# EAGLE design clock-digits (EAGLE 7.5.0)
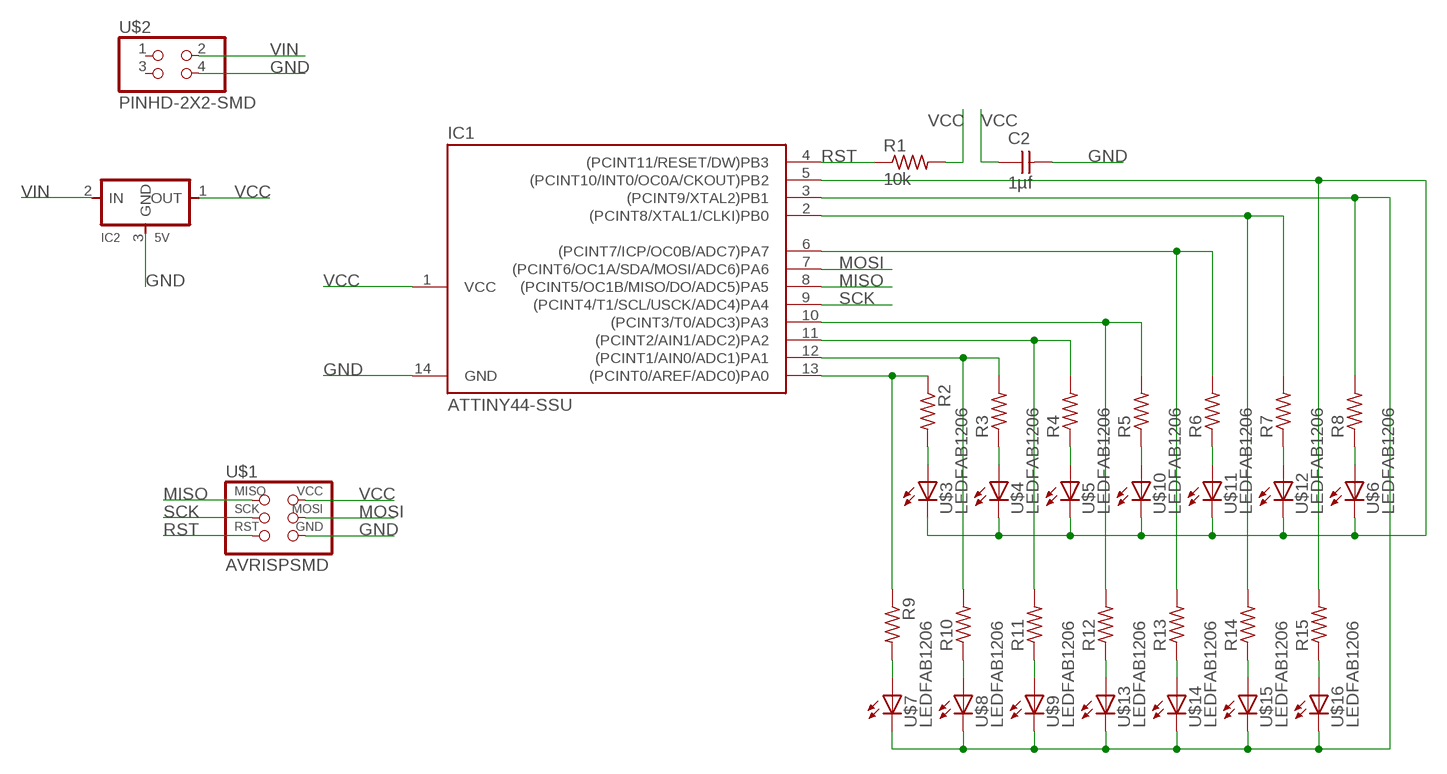
[diagram p0: schematic, sheet 1]

## Parts
C2  1µf  CAP-UNPOLARIZEDFAB  [C1206FAB]
IC1  ATTINY44-SSU  [SOIC14]
IC2  5V  REGULATORSOT23  [SOT23]
R1  10k  RES-US1206FAB  [R1206FAB]
R2  RES-US1206FAB  [R1206FAB]
R3  RES-US1206FAB  [R1206FAB]
R4  RES-US1206FAB  [R1206FAB]
R5  RES-US1206FAB  [R1206FAB]
R6  RES-US1206FAB  [R1206FAB]
R7  RES-US1206FAB  [R1206FAB]
R8  RES-US1206FAB  [R1206FAB]
R9  RES-US1206FAB  [R1206FAB]
R10  RES-US1206FAB  [R1206FAB]
R11  RES-US1206FAB  [R1206FAB]
R12  RES-US1206FAB  [R1206FAB]
R13  RES-US1206FAB  [R1206FAB]
R14  RES-US1206FAB  [R1206FAB]
R15  RES-US1206FAB  [R1206FAB]
U$1  AVRISPSMD  [2X03SMD]
U$2  PINHD-2X2-SMD  [2X02SMD]
U$3  LEDFAB1206  [LED1206FAB]
U$4  LEDFAB1206  [LED1206FAB]
U$5  LEDFAB1206  [LED1206FAB]
U$6  LEDFAB1206  [LED1206FAB]
U$7  LEDFAB1206  [LED1206FAB]
U$8  LEDFAB1206  [LED1206FAB]
U$9  LEDFAB1206  [LED1206FAB]
U$10  LEDFAB1206  [LED1206FAB]
U$11  LEDFAB1206  [LED1206FAB]
U$12  LEDFAB1206  [LED1206FAB]
U$13  LEDFAB1206  [LED1206FAB]
U$14  LEDFAB1206  [LED1206FAB]
U$15  LEDFAB1206  [LED1206FAB]
U$16  LEDFAB1206  [LED1206FAB]

## Nets
GND: C2.2 IC1.14(GND) IC2.3(GND) U$1.6(GND) U$2.4
MISO: IC1.8((PCINT5/OC1B/MISO/DO/ADC5)PA5) U$1.1(MISO)
MOSI: IC1.7((PCINT6/OC1A/SDA/MOSI/ADC6)PA6) U$1.4(MOSI)
N$1: IC1.13((PCINT0/AREF/ADC0)PA0) R2.1 R9.1
N$2: R2.2 U$3.1(A)
N$3: IC1.12((PCINT1/AIN0/ADC1)PA1) R3.2 R10.2
N$4: R3.1 U$4.1(A)
N$5: IC1.11((PCINT2/AIN1/ADC2)PA2) R4.2 R11.2
N$6: R4.1 U$5.1(A)
N$7: IC1.10((PCINT3/T0/ADC3)PA3) R5.2 R12.2
N$8: R5.1 U$10.1(A)
N$9: IC1.6((PCINT7/ICP/OC0B/ADC7)PA7) R6.2 R13.2
N$10: R6.1 U$11.1(A)
N$11: IC1.2((PCINT8/XTAL1/CLKI)PB0) R7.2 R14.2
N$12: R7.1 U$12.1(A)
N$14: R8.1 U$6.1(A)
N$15: IC1.5((PCINT10/INT0/OC0A/CKOUT)PB2) R15.2 U$3.2(C) U$4.2(C) U$5.2(C) U$6.2(C) U$10.2(C) U$11.2(C) U$12.2(C)
N$16: R9.2 U$7.1(A)
N$17: R15.1 U$16.1(A)
N$18: R10.1 U$8.1(A)
N$20: R11.1 U$9.1(A)
N$21: R12.1 U$13.1(A)
N$23: R13.1 U$14.1(A)
N$24: R14.1 U$15.1(A)
N$28: IC1.3((PCINT9/XTAL2)PB1) R8.2 U$7.2(C) U$8.2(C) U$9.2(C) U$13.2(C) U$14.2(C) U$15.2(C) U$16.2(C)
RST: IC1.4((PCINT11/RESET/DW)PB3) R1.1 U$1.5(RST)
SCK: IC1.9((PCINT4/T1/SCL/USCK/ADC4)PA4) U$1.3(SCK)
VCC: C2.1 IC1.1(VCC) IC2.1(OUT) R1.2 U$1.2(VCC)
VIN: IC2.2(IN) U$2.2
Unconnected: U$2.1 U$2.3

## Library data of the parts
C2 = fab:CAP-UNPOLARIZED
IC1 = fab:ATTINY44
IC2 = fab:REGULATOR
R1-R15 = fab:RES-US: Resistor (US Symbol) Variants with postfix FAB are widened to allow the routing of internal traces
U$1 = fab:AVRISP
U$2 = fab:PINHD-2X2-SMD
U$3-U$16 = fab:LED: LED

## Net classes
0 default: width 0.457 mm, clearance 1.626 mm

## Board
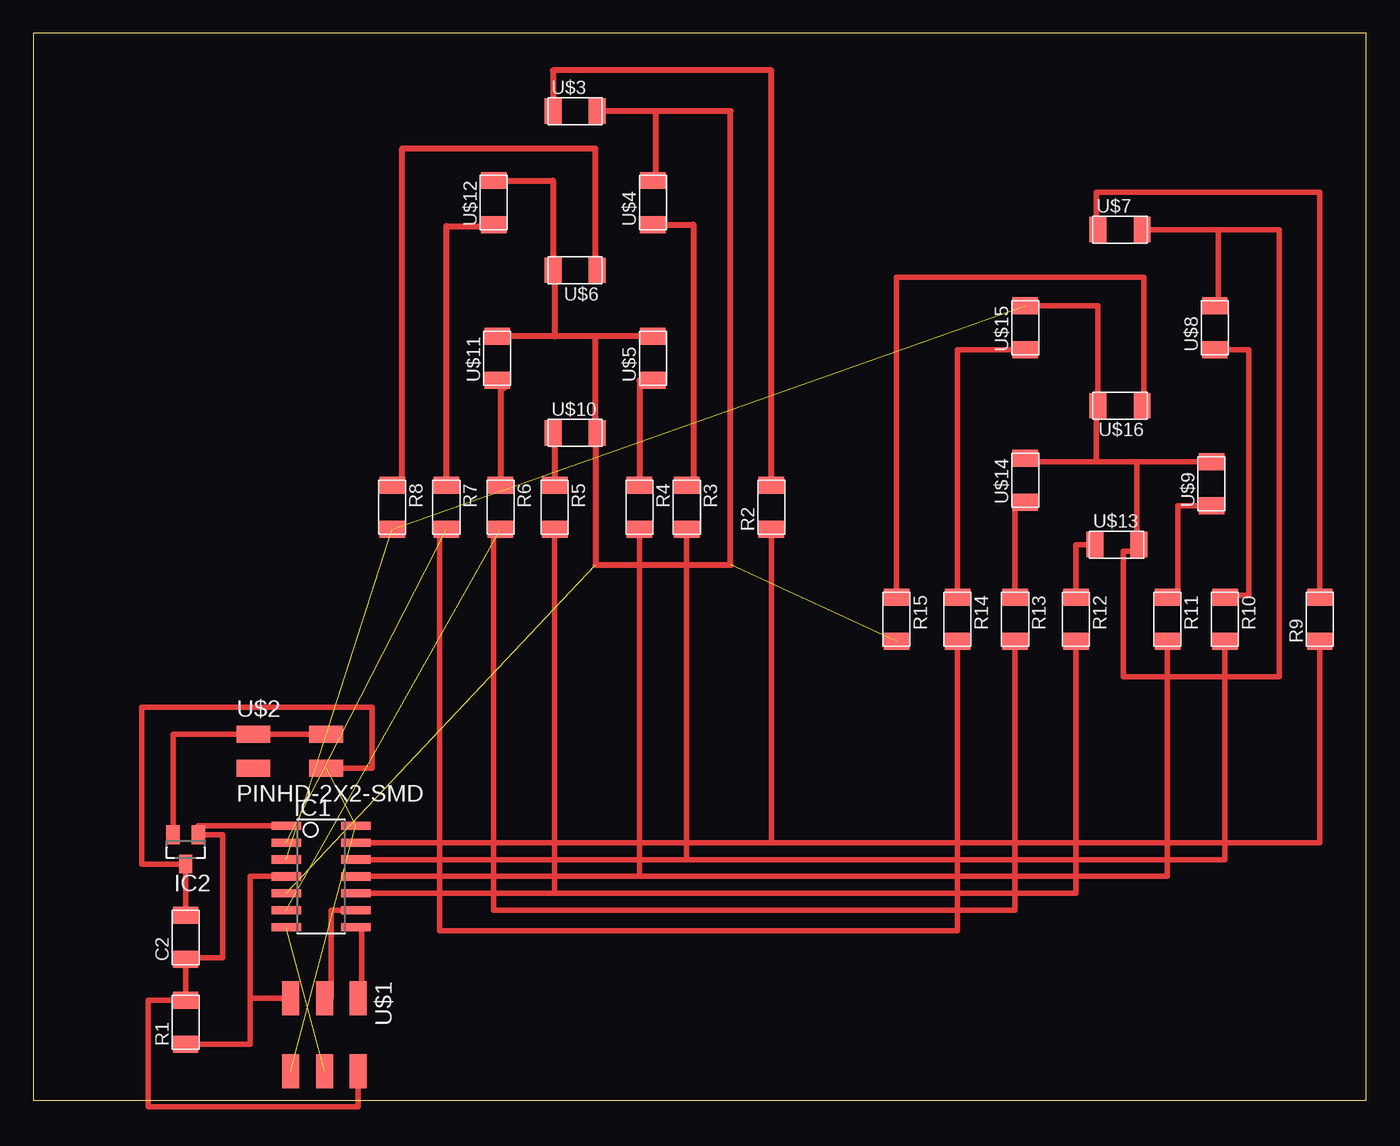
[diagram p1: board, top side]

Size 100 x 80 mm. Coordinates in mm from the lower left corner, seen from the top.
Outline: 0,0 100,0 100,80 0,80 0,0
Copper layers (1*16): Top 0.035mm / dielectric 1.5mm / Bottom 0.035mm
Design rules "fab": minimum track width 0.3mm, minimum drill 32mil, track to track 0.397mm, track to pad 0.397mm, pad to pad 0.397mm, via to via 0.397mm, smd to smd 0.315mm, copper to edge 40mil, drill to drill 16mil, minimum pad ring 10mil, minimum via ring 8mil, stop-mask expansion 4mil, vias tented up to drill 0mil, thermal gap 10mil

### Footprints (pad centres in the part's own frame; a part is rotated, then mirrored left to right if it is on the bottom)
C1206FAB = smd 1.27 x 1.905: 1 -1.651,0; 2 1.651,0
SOIC14 = smd 0.61 x 2.21: 1 -3.81,-2.603; 2 -2.54,-2.603; 3 -1.27,-2.603; 4 0,-2.603; 5 1.27,-2.603; 6 2.54,-2.603; 7 3.81,-2.603; 8 3.81,2.603; 9 2.54,2.603; 10 1.27,2.603; 11 0,2.603; 12 -1.27,2.603; 13 -2.54,2.603; 14 -3.81,2.603
SOT23 = smd 1 x 1.4: 1 -0.95,-1.1; 2 0.95,-1.1; 3 0,1.1
R1206FAB = smd 1.27 x 1.905: 1 -1.651,0; 2 1.651,0
2X03SMD = smd 2.54 x 1.27: 1 -2.54,2.54; 2 2.92,2.54; 3 -2.54,0; 4 2.92,0; 5 -2.54,-2.54; 6 2.92,-2.54
2X02SMD = smd 2.54 x 1.27: 1 -2.54,1.27; 2 2.92,1.27; 3 -2.54,-1.27; 4 2.92,-1.27
LED1206FAB = smd 1.27 x 1.905: 1 -1.651,0; 2 1.651,0

### Placement (x,y rotation side)
C2  11.43,12.19 90 top
IC1  21.59,16.76 270 top
IC2  11.43,18.8 180 top
R1  11.43,5.84 90 top
R2  55.37,44.45 90 top
R3  49.02,44.45 270 top
R4  45.47,44.45 270 top
R5  39.12,44.45 270 top
R6  35.05,44.45 270 top
R7  30.99,44.45 270 top
R8  26.92,44.45 270 top
R9  96.52,36.07 90 top
R10  89.41,36.07 270 top
R11  85.09,36.07 270 top
R12  78.23,36.07 270 top
R13  73.66,36.07 270 top
R14  69.34,36.07 270 top
R15  64.77,36.07 270 top
U$1  21.84,5.08 270 top
U$2  19.05,26.16 0 top
U$3  40.64,74.17 0 top
U$4  46.48,67.31 90 top
U$5  46.48,55.63 90 top
U$6  40.64,62.23 180 top
U$7  81.53,65.28 0 top
U$8  88.65,57.91 90 top
U$9  88.39,46.23 90 top
U$10  40.64,50.04 0 top
U$11  34.8,55.63 90 top
U$12  34.54,67.31 90 top
U$13  81.28,41.66 0 top
U$14  74.42,46.48 90 top
U$15  74.42,57.91 90 top
U$16  81.53,52.07 180 top

### Tracks (layer width: path | path; a pad name or v marks a point on that pad's centre or on a via)
GND  (2 unrouted)
  Top 0.406: C2.2 IC2.3 8.13,17.7 8.13,29.46 25.4,29.46 25.4,24.89 U$2.4
MISO
  Top 0.406: U$1.1 24.64,7.62 24.64,12.95 IC1.8
MOSI  (1 unrouted)
N$1
  Top 0.406: R9.1 96.52,19.3 55.37,19.3 | 55.37,19.3 IC1.13 | R2.1 55.37,19.3
N$2
  Top 0.457: R2.2 55.37,77.22 38.99,77.22 U$3.1
N$3
  Top 0.406: R10.2 89.41,18.03 49.02,18.03 | IC1.12 48.77,18.03 49.02,18.03 | R3.2 49.02,18.03
N$4
  Top 0.457: U$4.1 49.53,65.66 49.53,46.48 49.02,46.48 R3.1
N$5
  Top 0.406: R11.2 85.09,16.76 45.72,16.76 45.47,16.76 | 45.47,16.76 IC1.11 | R4.2 45.47,16.76
N$6
  Top 0.457: U$5.1 45.47,53.98 R4.1
  Top 0.61: R4.1 45.72,46.23
N$7
  Top 0.406: R12.2 78.23,15.49 39.12,15.49 | 39.12,15.49 IC1.10 | R5.2 39.12,15.49
N$8
  Top 0.457: U$10.1 39.12,50.04 R5.1
  Top 0.61: 39.5,46.1 R5.1 39.88,46.23 39.37,46.23
N$9  (1 unrouted)
  Top 0.406: R13.2 73.66,14.22 34.54,14.22 34.54,42.8 R6.2
N$10
  Top 0.457: 35.31,53.47 35.05,53.47 R6.1
  Top 0.61: U$11.1 35.31,53.47
N$11  (1 unrouted)
  Top 0.406: R14.2 69.34,12.7 30.48,12.7 30.48,42.8 R7.2
N$12
  Top 0.457: R7.1 30.99,65.53 34.8,65.53 U$12.1
N$14
  Top 0.457: R8.1 27.69,46.1 27.69,71.37 42.16,71.37 42.16,62.99 42.29,62.99 U$6.1
N$15  (2 unrouted)
  Top 0.457: U$12.2 38.99,68.96 U$6.2 39.12,62.23 39.12,57.28 | U$5.2 42.16,57.28 | 42.16,57.28 39.12,57.28 | 39.12,57.28 U$11.2 | U$10.2 42.16,50.04 | 42.16,50.04 42.16,57.28 | 42.16,50.04 42.16,40.13 52.32,40.13 52.32,74.17 46.74,74.17 | 46.74,74.17 U$3.2 | U$4.2 46.74,68.96 46.74,74.17
N$16
  Top 0.406: U$7.1 79.76,65.28 79.76,68.07 96.52,68.07 R9.2
N$17
  Top 0.406: R15.1 64.77,61.72 83.31,61.72 83.31,52.07 U$16.1
N$18
  Top 0.406: U$8.1 91.19,56.26 91.19,37.85 89.41,37.85 R10.1
N$20
  Top 0.406: U$9.1 85.85,44.58 85.85,37.85 85.09,37.85 R11.1
N$21
  Top 0.406: U$13.1 78.23,41.66 R12.1
N$23
  Top 0.406: U$14.1 73.66,44.83 R13.1
N$24
  Top 0.406: U$15.1 69.34,56.26 R14.1
N$28  (2 unrouted)
  Top 0.406: U$7.2 88.9,65.28 | 88.9,65.28 93.47,65.28 93.47,31.75 81.79,31.75 81.79,41.15 82.93,41.15 U$13.2 82.8,41.66 82.8,47.88 | U$8.2 88.9,59.56 88.9,65.28 | U$9.2 82.8,47.88 | 82.8,47.88 79.76,47.88 | 79.76,47.88 74.42,47.88 U$14.2 | 79.76,47.88 79.76,52.07 U$16.2 79.88,59.56 U$15.2
RST
  Top 0.406: R1.1 16.26,4.19 16.26,7.62 | IC1.4 16.26,16.76 16.26,8.13 16.26,7.62 | U$1.5 16.26,7.62
SCK
  Top 0.406: U$1.3 22.35,7.62 22.35,14.22 IC1.9
VCC
  Top 0.406: IC1.1 12.38,20.57 IC2.1 14.22,19.9 14.22,10.67 11.43,10.67 C2.1 R1.2 8.64,7.49 8.64,-0.51 24.38,-0.51 U$1.2
VIN
  Top 0.406: U$2.2 10.48,27.43 IC2.2